# EAGLE schematic gyro-board (EAGLE 6.6.0)
DESIGNER: JONNEW, MWL@MIT; DESIGN_NAME: GYRO BOARD; LICENSE: (C) Jon Newman CC-BY-SA-NC 4.0
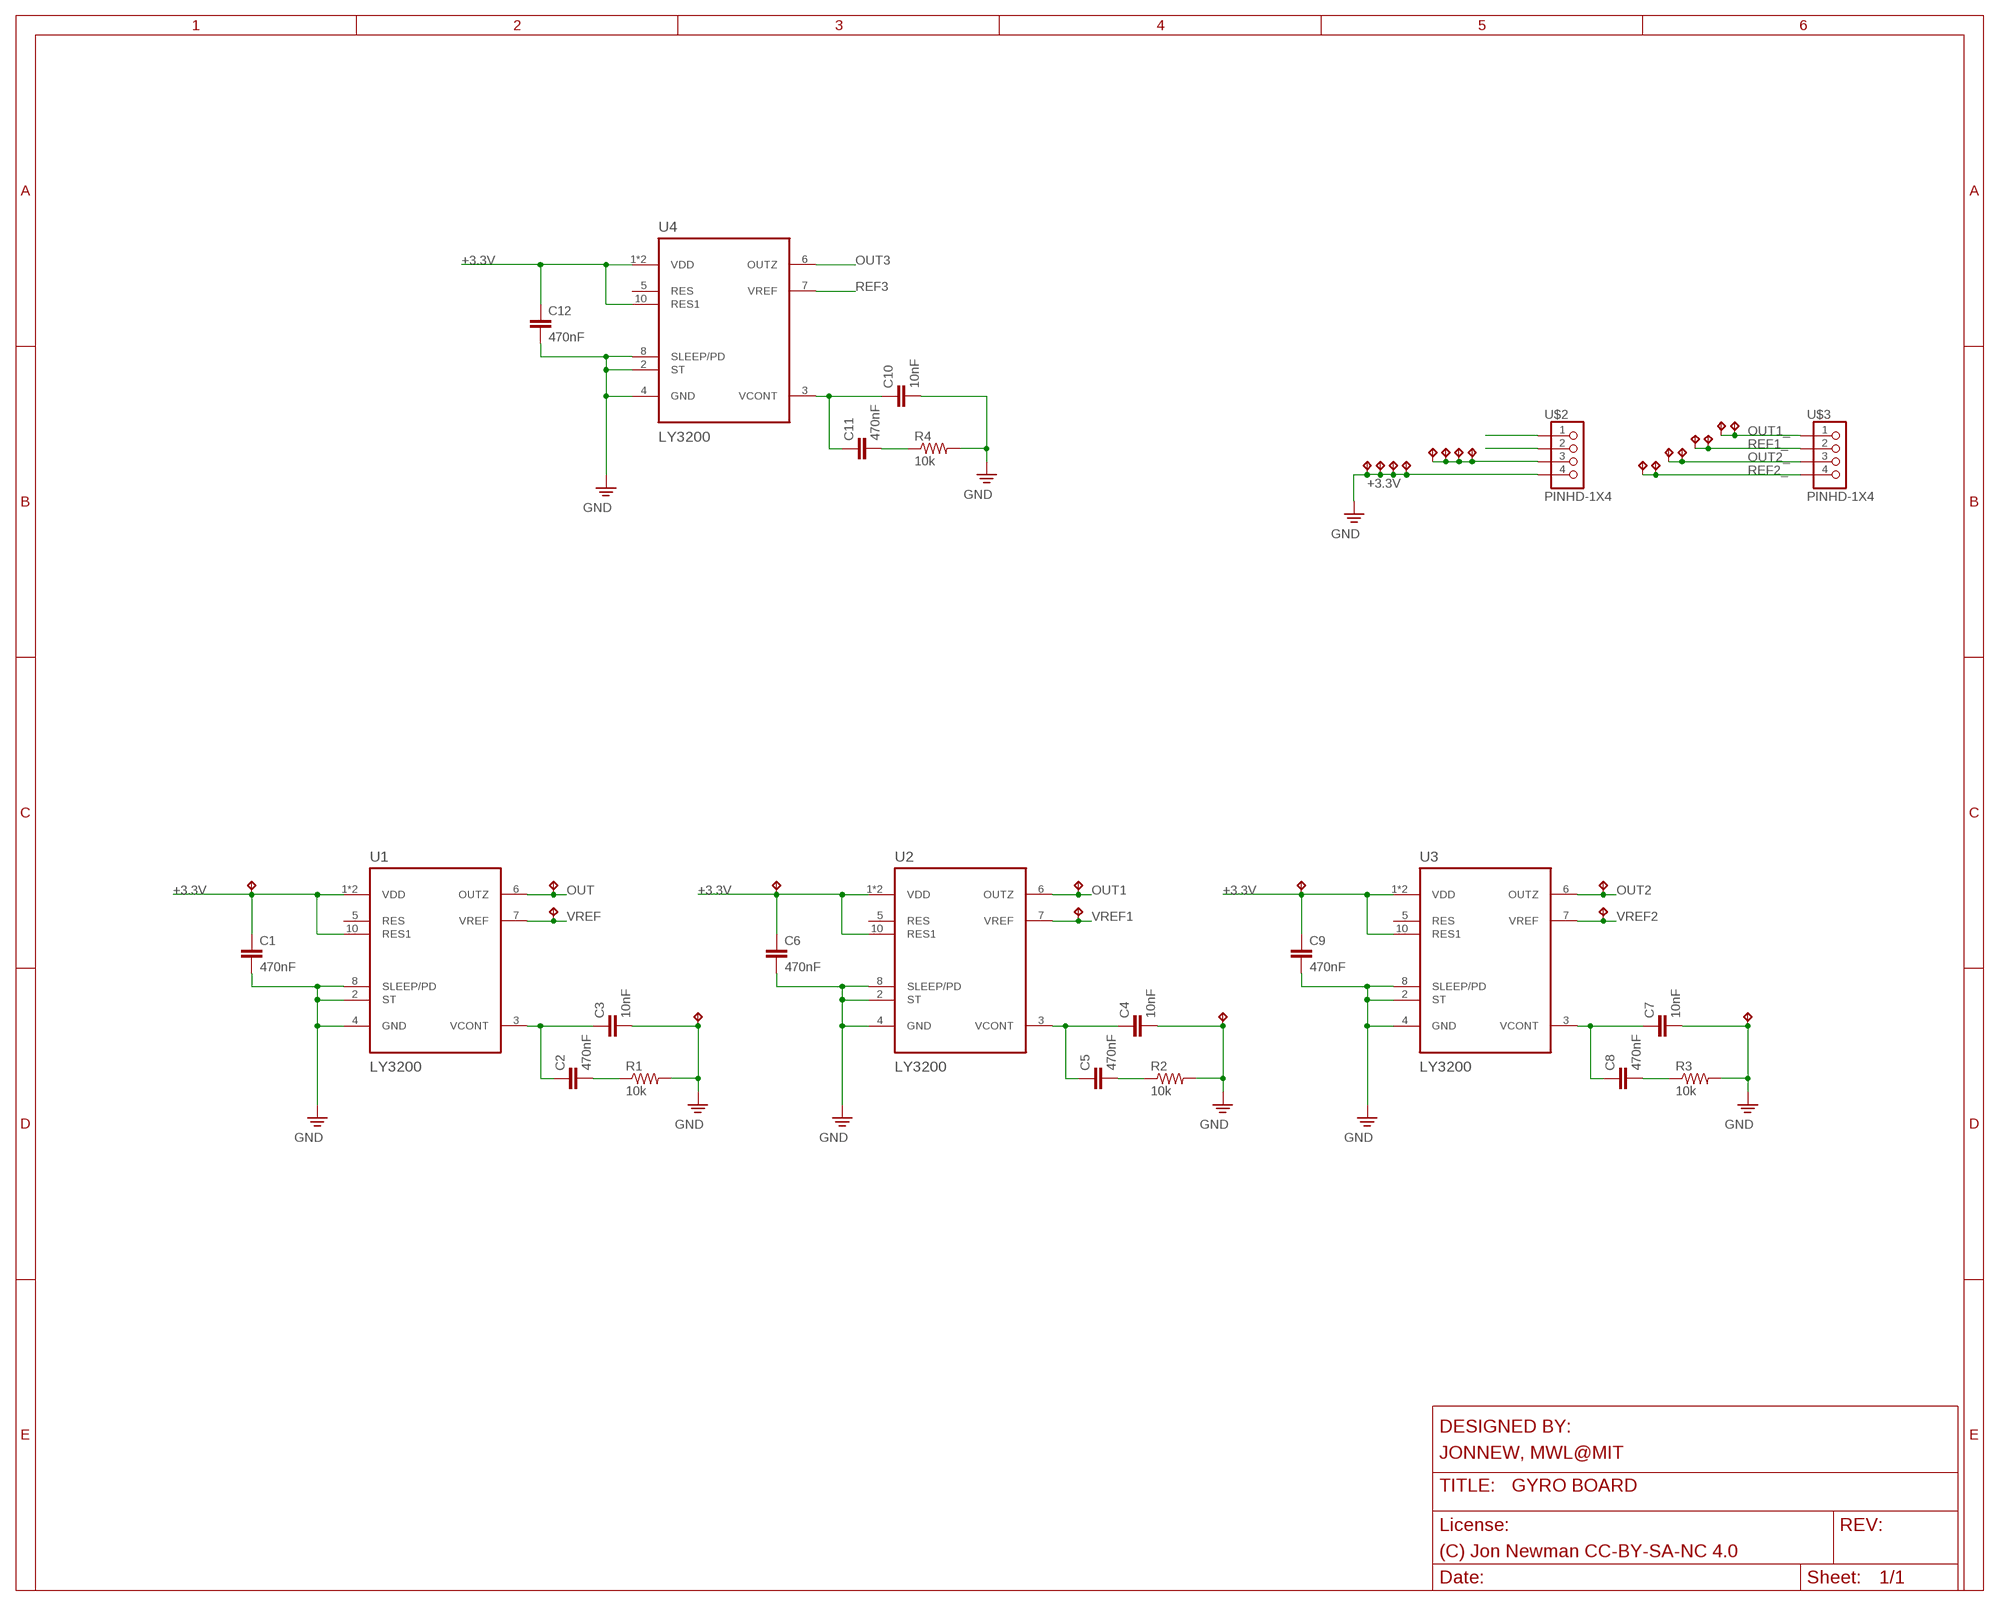
[diagram p0: schematic, sheet 1]

## Parts
C1  470nF  C_0201  [0201]
C2  470nF  C_0201  [0201]
C3  10nF  C_0201  [0201]
C4  10nF  C_0201  [0201]
C5  470nF  C_0201  [0201]
C6  470nF  C_0201  [0201]
C7  10nF  C_0201  [0201]
C8  470nF  C_0201  [0201]
C9  470nF  C_0201  [0201]
C10  10nF  C_0201  [0201]
C11  470nF  C_0201  [0201]
C12  470nF  C_0201  [0201]
R1  10k  R_0201  [0201]
R2  10k  R_0201  [0201]
R3  10k  R_0201  [0201]
R4  10k  R_0201  [0201]
TP1  TPTP08SQ  [TP08SQ]
TP2  TPTP08SQ  [TP08SQ]
TP3  TPTP08SQ  [TP08SQ]
TP4  TPTP08SQ  [TP08SQ]
TP5  TPTP08SQ  [TP08SQ]
TP6  TPTP08SQ  [TP08SQ]
TP7  TPTP08SQ  [TP08SQ]
TP8  TPTP08SQ  [TP08SQ]
TP9  TPTP08SQ  [TP08SQ]
TP10  TPTP08SQ  [TP08SQ]
TP11  TPTP08SQ  [TP08SQ]
TP12  TPTP08SQ  [TP08SQ]
TP13  TPTP08SQ  [TP08SQ]
TP14  TPTP08SQ  [TP08SQ]
TP15  TPTP08SQ  [TP08SQ]
TP16  TPTP08SQ  [TP08SQ]
TP17  TPTP08SQ  [TP08SQ]
TP18  TPTP08SQ  [TP08SQ]
TP19  TPTP08SQ  [TP08SQ]
TP20  TPTP08SQ  [TP08SQ]
TP21  TPTP08SQ  [TP08SQ]
TP22  TPTP08SQ  [TP08SQ]
TP23  TPTP08SQ  [TP08SQ]
TP24  TPTP08SQ  [TP08SQ]
TP25  TPTP08SQ  [TP08SQ]
TP26  TPTP08SQ  [TP08SQ]
TP27  TPTP08SQ  [TP08SQ]
TP28  TPTP08SQ  [TP08SQ]
U1  LY3200  LY3200ALH_LGA-10-COMPACT  [LGA-10-COMPACT]
U2  LY3200  LY3200ALH_LGA-10-COMPACT  [LGA-10-COMPACT]
U3  LY3200  LY3200ALH_LGA-10-COMPACT  [LGA-10-COMPACT]
U4  LY3200  LY3200ALH_LGA-10-COMPACT  [LGA-10-COMPACT]
U$2  PINHD-1X4  [1X04]
U$3  PINHD-1X4  [1X04]

## Nets
+3.3V: C1.1 C6.1 C9.1 C12.1 TP1.TP TP4.TP TP9.TP TP25.TP TP26.TP TP27.TP TP28.TP U1.1(VDD) U1.9(VDD) U1.10(RES1) U2.1(VDD) U2.9(VDD) U2.10(RES1) U3.1(VDD) U3.9(VDD) U3.10(RES1) U4.1(VDD) U4.9(VDD) U4.10(RES1) U$2.3
GND: C1.2 C3.2 C4.2 C6.2 C7.2 C9.2 C10.2 C12.2 R1.2 R2.2 R3.2 R4.2 TP3.TP TP7.TP TP11.TP TP13.TP TP22.TP TP23.TP TP24.TP U1.2(ST) U1.4(GND) U1.8(SLEEP/PD) U2.2(ST) U2.4(GND) U2.8(SLEEP/PD) U3.2(ST) U3.4(GND) U3.8(SLEEP/PD) U4.2(ST) U4.4(GND) U4.8(SLEEP/PD) U$2.4
N$1: C4.1 C5.1 U2.3(VCONT)
N$2: C5.2 R2.1
N$3: C2.1 C3.1 U1.3(VCONT)
N$4: C2.2 R1.1
N$5: C7.1 C8.1 U3.3(VCONT)
N$6: C8.2 R3.1
N$7: C10.1 C11.1 U4.3(VCONT)
N$8: C11.2 R4.1
OUT: TP2.TP U1.6(OUTZ)
OUT1: TP6.TP U2.6(OUTZ)
OUT1_: TP20.TP TP21.TP U$3.1
OUT2: TP10.TP U3.6(OUTZ)
OUT2_: TP16.TP TP17.TP U$3.3
OUT3: U4.6(OUTZ) U$2.1
REF1_: TP18.TP TP19.TP U$3.2
REF2_: TP14.TP TP15.TP U$3.4
REF3: U4.7(VREF) U$2.2
VREF: TP5.TP U1.7(VREF)
VREF1: TP8.TP U2.7(VREF)
VREF2: TP12.TP U3.7(VREF)
Unconnected: U1.5(RES) U2.5(RES) U3.5(RES) U4.5(RES)

## Library data of the parts
C1-C12 = jonnew:C: Capacitor
R1-R4 = jonnew:R: Resistor
TP1-TP28 = jonnew:TP: Test pad
U1-U4 = jonnew:LY3200ALH
U$2 U$3 = jonnew:PINHD-1X4